# EAGLE schematic XiaomiWeatherStation (EAGLE 9.6.2)
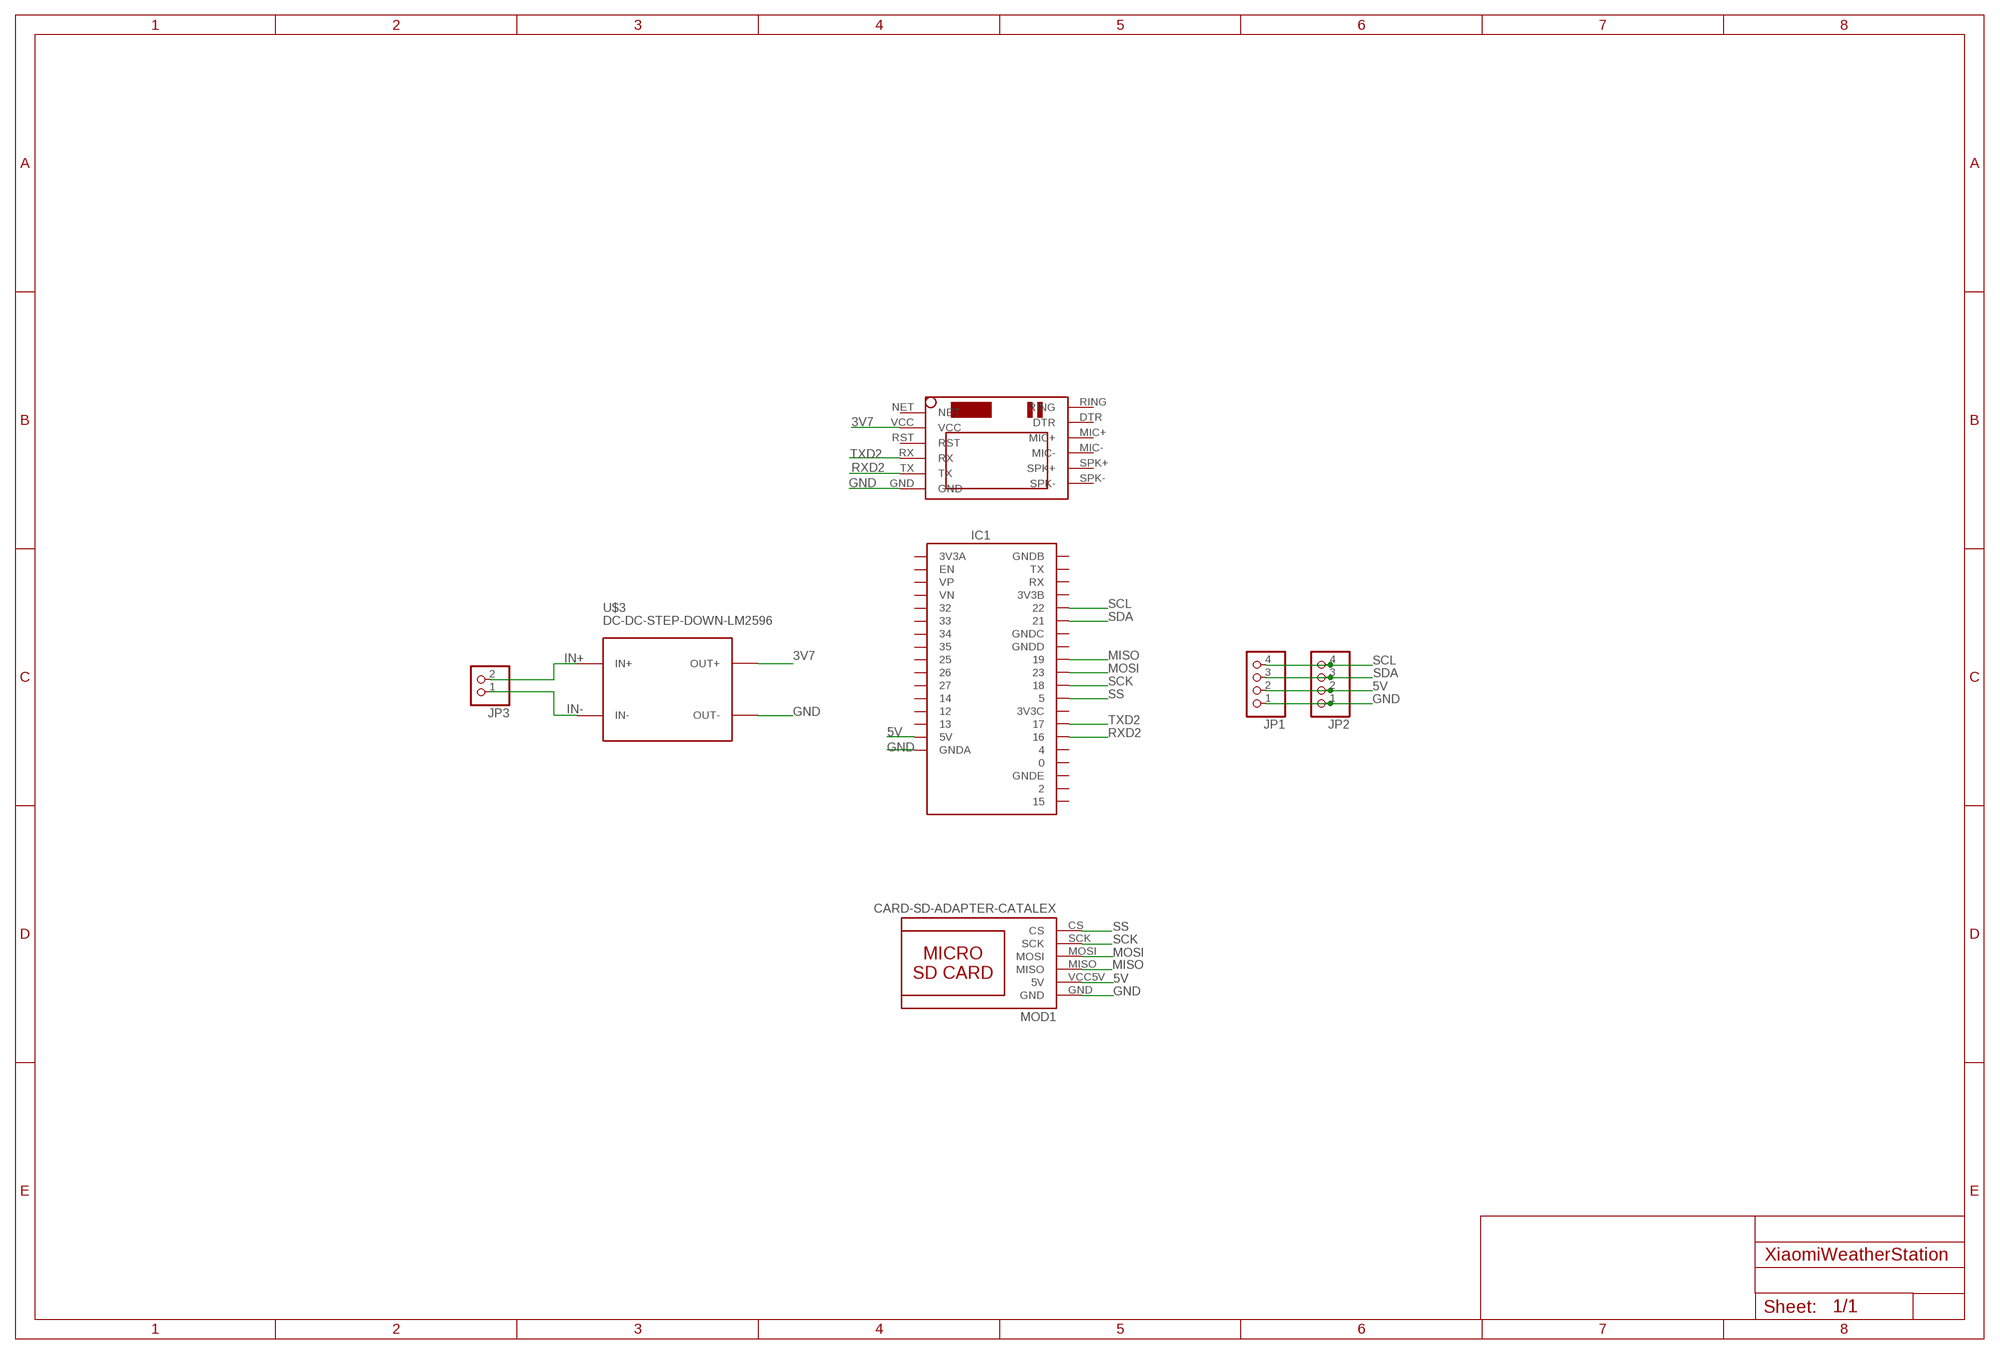
[diagram p0: schematic, sheet 1]

## Parts
IC1  SSFD_LOLIN32_WEMOS_CHINA_W_BATT  [SSFD_LOLIN32_WEMOS_CHINA_W_BATT]
JP1  PINHD-1X4  [1X04]
JP2  PINHD-1X4  [1X04]
JP3  PINHD-1X2  [1X02]
MOD1  CARD-SD-ADAPTER-CATALEX  [CARD-SD-ADAPTER-CATALEX]
U$1  SIM800LMODULE  [SIM800LMODULE]
U$3  DC-DC-STEP-DOWN-LM2596  [DC-DC-STEP-DOWN-LM2596]

## Nets
3V7: U$1.VCC U$3.OUT+
5V: IC1.5V JP1.2 JP2.2 MOD1.VCC5V(5V)
GND: IC1.GNDA JP1.1 JP2.1 MOD1.GND U$1.GND U$3.OUT-
IN+: JP3.2 U$3.IN+
IN-: JP3.1 U$3.IN-
MISO: IC1.19 MOD1.MISO
MOSI: IC1.23 MOD1.MOSI
RXD2: IC1.16 U$1.TX
SCK: IC1.18 MOD1.SCK
SCL: IC1.22 JP1.4 JP2.4
SDA: IC1.21 JP1.3 JP2.3
SS: IC1.5 MOD1.CS
TXD2: IC1.17 U$1.RX
Unconnected: IC1.0 IC1.2 IC1.3V3A IC1.3V3B IC1.3V3C IC1.4 IC1.12 IC1.13 IC1.14 IC1.15 IC1.25 IC1.26 IC1.27 IC1.32 IC1.33 IC1.34 IC1.35 IC1.EN IC1.GNDB IC1.GNDC IC1.GNDD IC1.GNDE IC1.RX IC1.TX IC1.VN IC1.VP U$1.DTR U$1.MIC+ U$1.MIC- U$1.NET U$1.RING U$1.RST U$1.SPK+ U$1.SPK-

## Library data of the parts
IC1 = SSFD - ESP32 WEMOS LOLIN CHINA W_BATT:SSFD_LOLIN32_WEMOS_CHINA_W_BATT: BY SEGASONICFAN DESIGNS HTTP://WWW.SEGASONICFAN.WIXSITE.COM/RETRO WEMOS ESP32 BREAKOUT 4MB CHINA WITH BATTERY CONNECTOR https://arduino-projekte.info/wemos-lolin32/ https://diyprojects.io/wemos-lolin32-new-development-board-esp32-e645-4mb-memory-lipo-battery-connector/
JP1 JP2 = pinhead:PINHD-1X4: PIN HEADER
JP3 = pinhead:PINHD-1X2: PIN HEADER
MOD1 = SD-Card-Module_CATALEX:CARD-SD-ADAPTER-CATALEX: Micro SD Card Adapter Module with onboard 3.3V regulator
U$1 = SIM800LMODULE:SIM800LMODULE: SIM800L Module
U$3 = diy-modules:DC-DC-STEP-DOWN-LM2596: DC/DC Step-Down Regulator based on LM2596-ADJ chip LM2596 datasheet available here: http://www.ti.com/lit/ds/symlink/lm2596.pdf Click here to find device on ebay.com <http://www.ebay.com/sch/lm2596+power+regulator>